# EAGLE schematic untitled (EAGLE 6.1)
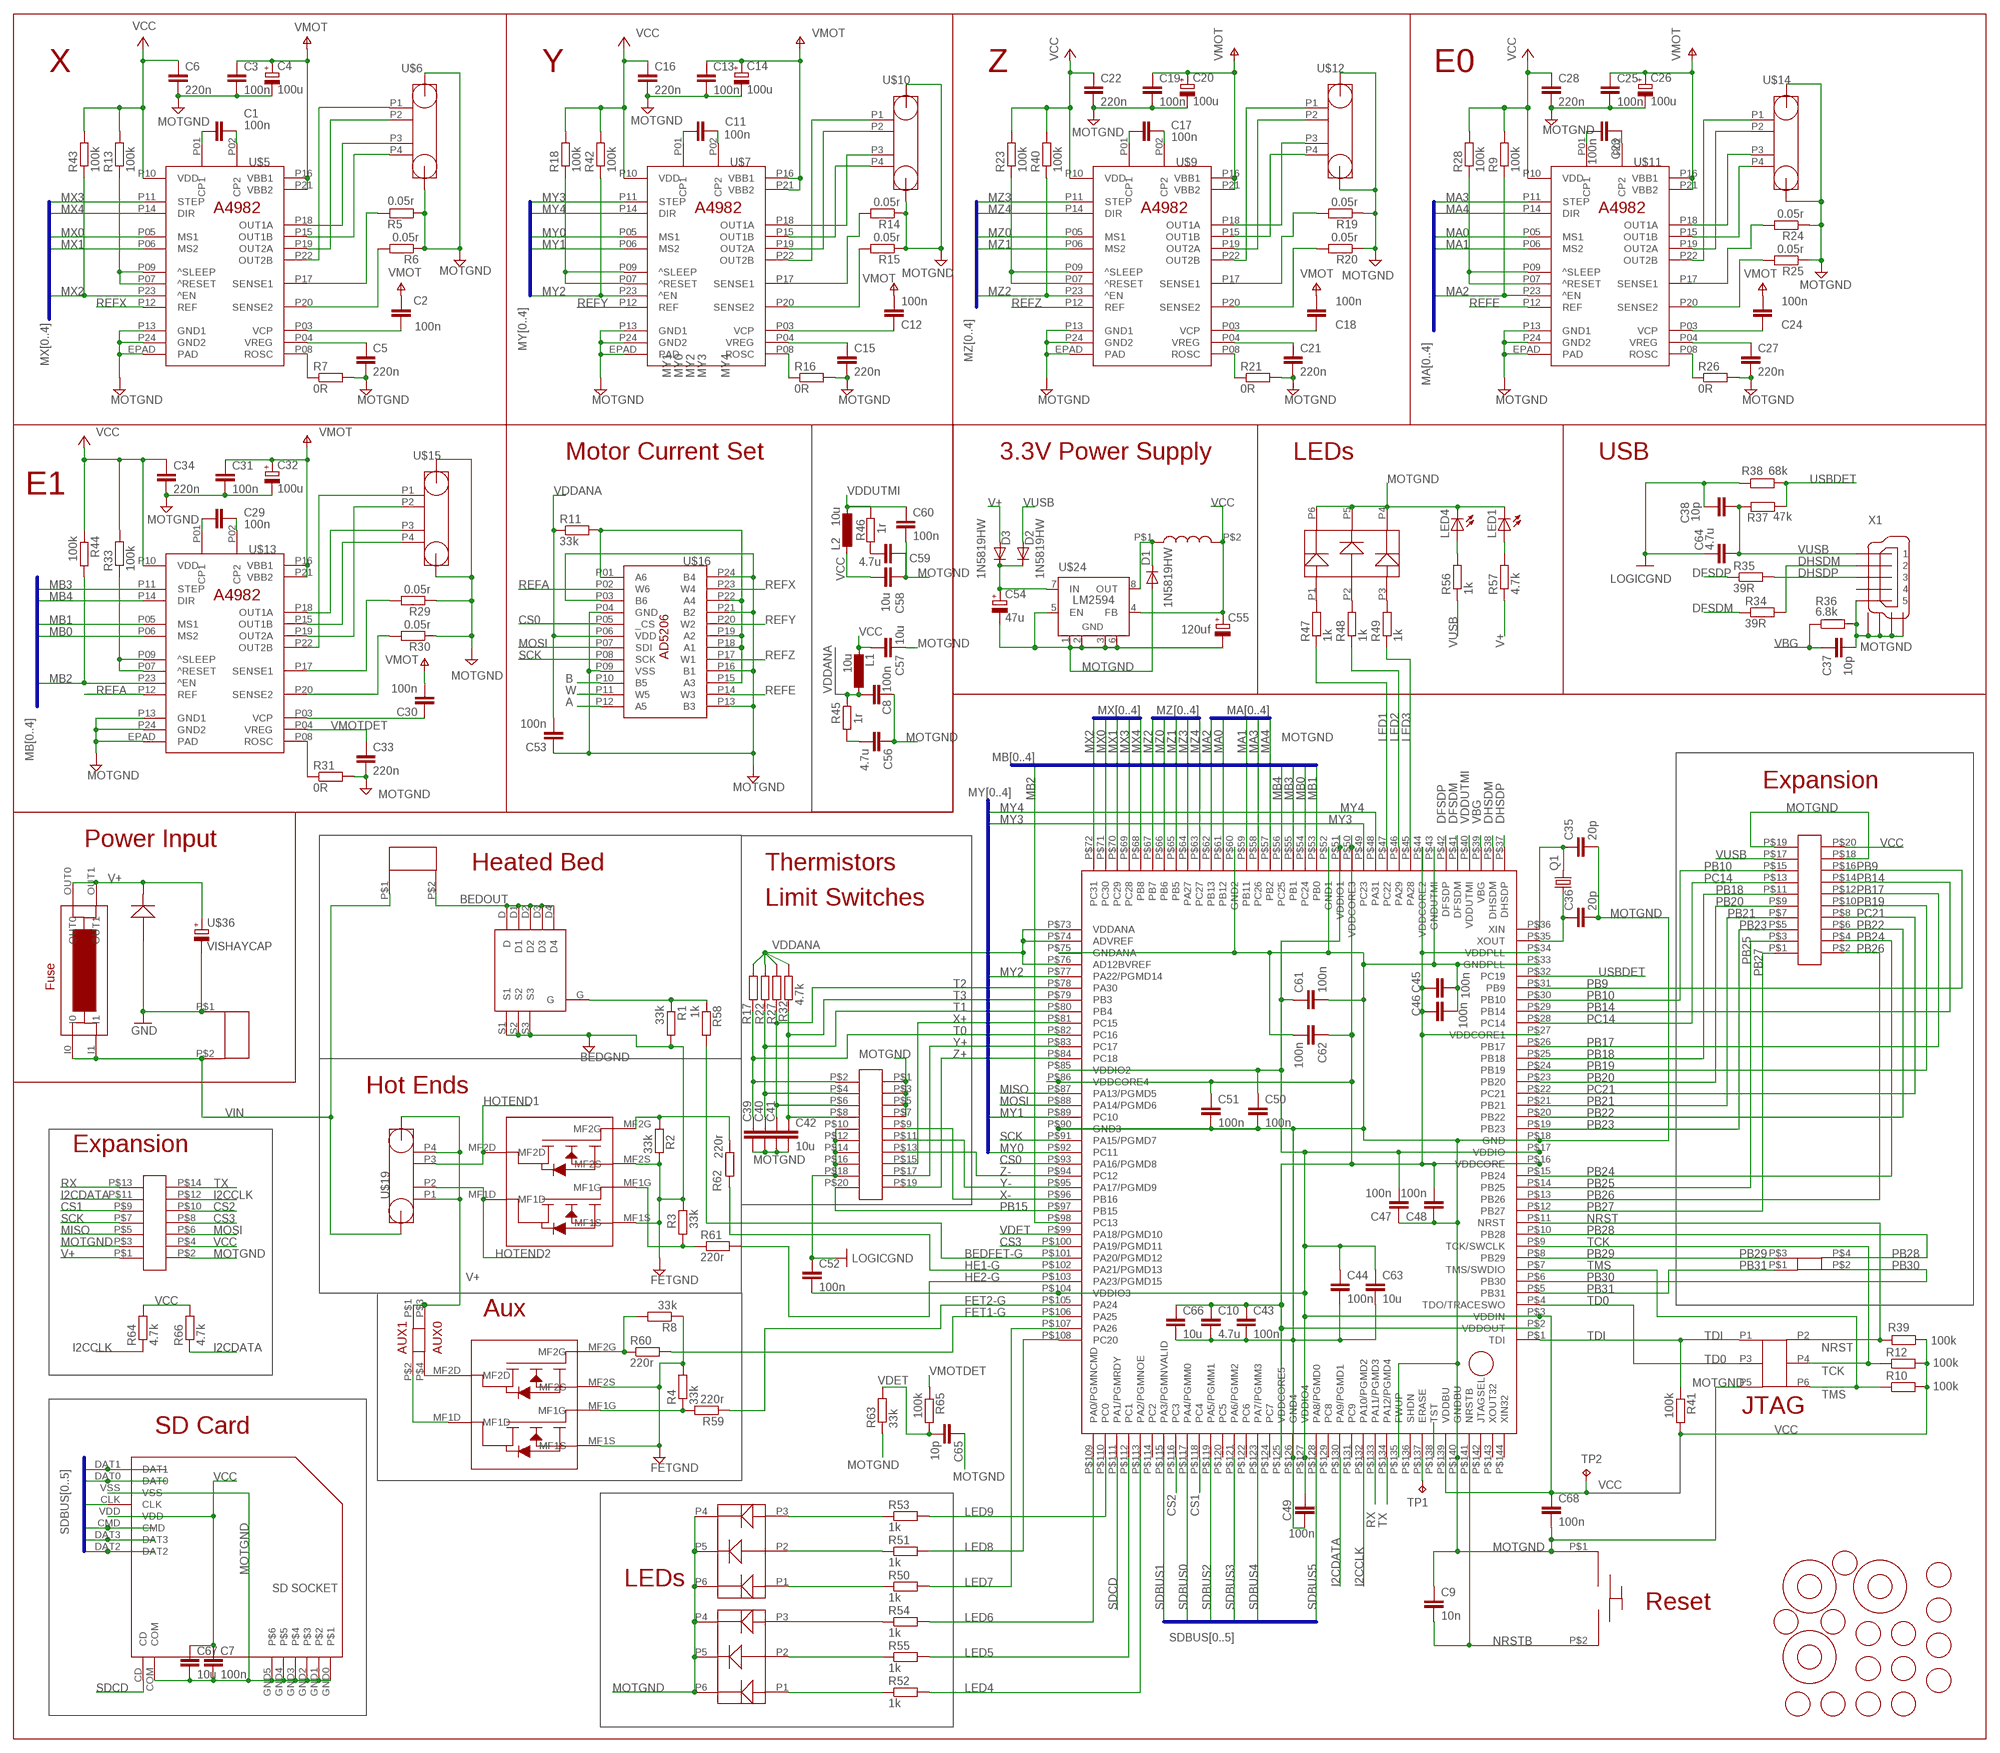
[diagram p0: schematic, sheet 1]

## Parts
C1  100n  C-EUC0603K  [C0603K]
C2  100n  C-EUC0603K  [C0603K]
C3  100n  C-EUC0603K  [C0603K]
C4  100u  CPOL-EUUD-6,3X7,7  [UD-6,3X7,7_NICHICON]
C5  220n  C-EUC0603K  [C0603K]
C6  220n  C-EUC0603K  [C0603K]
C7  100n  C-EUC0603K  [C0603K]
C8  100n  C-EUC0603K  [C0603K]
C9  10n  C-EUC0603K  [C0603K]
C10  4.7u  C-EUC0603K  [C0603K]
C11  100n  C-EUC0603K  [C0603K]
C12  100n  C-EUC0603K  [C0603K]
C13  100n  C-EUC0603K  [C0603K]
C14  100u  CPOL-EUUD-6,3X7,7  [UD-6,3X7,7_NICHICON]
C15  220n  C-EUC0603K  [C0603K]
C16  220n  C-EUC0603K  [C0603K]
C17  100n  C-EUC0603K  [C0603K]
C18  100n  C-EUC0603K  [C0603K]
C19  100n  C-EUC0603K  [C0603K]
C20  100u  CPOL-EUUD-6,3X7,7  [UD-6,3X7,7_NICHICON]
C21  220n  C-EUC0603K  [C0603K]
C22  220n  C-EUC0603K  [C0603K]
C23  100n  C-EUC0603K  [C0603K]
C24  100n  C-EUC0603K  [C0603K]
C25  100n  C-EUC0603K  [C0603K]
C26  100u  CPOL-EUUD-6,3X7,7  [UD-6,3X7,7_NICHICON]
C27  220n  C-EUC0603K  [C0603K]
C28  220n  C-EUC0603K  [C0603K]
C29  100n  C-EUC0603K  [C0603K]
C30  100n  C-EUC0603K  [C0603K]
C31  100n  C-EUC0603K  [C0603K]
C32  100u  CPOL-EUUD-6,3X7,7  [UD-6,3X7,7_NICHICON]
C33  220n  C-EUC0603K  [C0603K]
C34  220n  C-EUC0603K  [C0603K]
C35  20p  C-EUC0603K  [C0603K]
C36  20p  C-EUC0603K  [C0603K]
C37  10p  C-EUC0603K  [C0603K]
C38  10p  C-EUC0603K  [C0603K]
C39  10u  C-EUC0603K  [C0603K]
C40  10u  C-EUC0603K  [C0603K]
C41  10u  C-EUC0603K  [C0603K]
C42  10u  C-EUC0603K  [C0603K]
C43  100n  C-EUC0603K  [C0603K]
C44  100n  C-EUC0603K  [C0603K]
C45  100n  C-EUC0603K  [C0603K]
C46  100n  C-EUC0603K  [C0603K]
C47  100n  C-EUC0603K  [C0603K]
C48  100n  C-EUC0603K  [C0603K]
C49  100n  C-EUC0603K  [C0603K]
C50  100n  C-EUC0603K  [C0603K]
C51  100n  C-EUC0603K  [C0603K]
C52  100n  C-EUC0603K  [C0603K]
C53  100n  C-EUC0603K  [C0603K]
C54  47u  CPOL-EUD/7343-31R  [D/7343-31R]
C55  120uf  CPOL-EU153CLV-0807  [153CLV-0807]
C56  4.7u  C-EUC0603K  [C0603K]
C57  10u  C-EUC0603K  [C0603K]
C58  10u  C-EUC0603K  [C0603K]
C59  4.7u  C-EUC0603K  [C0603K]
C60  100n  C-EUC0603K  [C0603K]
C61  100n  C-EUC0603K  [C0603K]
C62  100n  C-EUC0603K  [C0603K]
C63  10u  C-EUC0603K  [C0603K]
C64  4.7u  C-EUC0603K  [C0603K]
C65  10p  C-EUC0603K  [C0603K]
C66  10u  C-EUC0603K  [C0603K]
C67  10u  C-EUC0603K  [C0603K]
C68  100n  C-EUC0603K  [C0603K]
D1  1N5819HW  DIODE-SOD123  [SOD123]
D2  1N5819HW  DIODE-SOD123  [SOD123]
D3  1N5819HW  DIODE-SOD123  [SOD123]
L1  10u  L-EUL2825P  [L2825P]
L2  10u  L-EUL2825P  [L2825P]
LED1  LEDCHIPLED_0805  [CHIPLED_0805]
LED4  LEDCHIPLED_0805  [CHIPLED_0805]
Q1  CSM-7X-DU  [CSM-7X-DU]
R1  33k  R-EU_R0603  [R0603]
R2  33k  R-EU_R0603  [R0603]
R3  33k  R-EU_R0603  [R0603]
R4  33k  R-EU_R0603  [R0603]
R5  0.05r  R-EU_R2512  [R2512]
R6  0.05r  R-EU_R2512  [R2512]
R7  0R  R-EU_R0603  [R0603]
R8  33k  R-EU_R0603  [R0603]
R9  100k  R-EU_R0603  [R0603]
R10  100k  R-EU_R0603  [R0603]
R11  33k  R-EU_R0603  [R0603]
R12  100k  R-EU_R0603  [R0603]
R13  100k  R-EU_R0603  [R0603]
R14  0.05r  R-EU_R2512  [R2512]
R15  0.05r  R-EU_R2512  [R2512]
R16  0R  R-EU_R0603  [R0603]
R17  4.7k  R-EU_R0603  [R0603]
R18  100k  R-EU_R0603  [R0603]
R19  0.05r  R-EU_R2512  [R2512]
R20  0.05r  R-EU_R2512  [R2512]
R21  0R  R-EU_R0603  [R0603]
R22  4.7k  R-EU_R0603  [R0603]
R23  100k  R-EU_R0603  [R0603]
R24  0.05r  R-EU_R2512  [R2512]
R25  0.05r  R-EU_R2512  [R2512]
R26  0R  R-EU_R0603  [R0603]
R27  4.7k  R-EU_R0603  [R0603]
R28  100k  R-EU_R0603  [R0603]
R29  0.05r  R-EU_R2512  [R2512]
R30  0.05r  R-EU_R2512  [R2512]
R31  0R  R-EU_R0603  [R0603]
R32  4.7k  R-EU_R0603  [R0603]
R33  100k  R-EU_R0603  [R0603]
R34  39R  R-EU_R0603  [R0603]
R35  39R  R-EU_R0603  [R0603]
R36  6.8k  R-EU_R0603  [R0603]
R37  47k  R-EU_R0603  [R0603]
R38  68k  R-EU_R0603  [R0603]
R39  100k  R-EU_R0603  [R0603]
R40  100k  R-EU_R0603  [R0603]
R41  100k  R-EU_R0603  [R0603]
R42  100k  R-EU_R0603  [R0603]
R43  100k  R-EU_R0603  [R0603]
R44  100k  R-EU_R0603  [R0603]
R45  1r  R-EU_R0603  [R0603]
R46  1r  R-EU_R0603  [R0603]
R47  1k  R-EU_R0603  [R0603]
R48  1k  R-EU_R0603  [R0603]
R49  1k  R-EU_R0603  [R0603]
R50  1k  R-EU_R0603  [R0603]
R51  1k  R-EU_R0603  [R0603]
R52  1k  R-EU_R0603  [R0603]
R53  1k  R-EU_R0603  [R0603]
R54  1k  R-EU_R0603  [R0603]
R55  1k  R-EU_R0603  [R0603]
R56  1k  R-EU_R0603  [R0603]
R57  4.7k  R-EU_R0603  [R0603]
R58  1k  R-EU_R0603  [R0603]
R59  220r  R-EU_R0603  [R0603]
R60  220r  R-EU_R0603  [R0603]
R61  220r  R-EU_R0603  [R0603]
R62  220r  R-EU_R0603  [R0603]
R63  33k  R-EU_R0603  [R0603]
R64  4.7k  R-EU_R0603  [R0603]
R65  100k  R-EU_R0603  [R0603]
R66  4.7k  R-EU_R0603  [R0603]
TP1  TPTP20R  [TP20R]
TP2  TPTP20R  [TP20R]
U$1  IPG20N04S4L-11  [SUPERSO8]
U$2  IPG20N04S4L-11  [SUPERSO8]
U$3  SMD.1X20  [SMD0.1X20]
U$4  IRFH6200  [PQFNFET]
U$5  A4982  [ETSSOP24]
U$6  210-A-126-SMD  [210-A-126-SMD-4]
U$7  A4982  [ETSSOP24]
U$8  SAM3U4E  [LQFP144]
U$9  A4982  [ETSSOP24]
U$10  210-A-126-SMD  [210-A-126-SMD-4]
U$11  A4982  [ETSSOP24]
U$12  210-A-126-SMD  [210-A-126-SMD-4]
U$13  A4982  [ETSSOP24]
U$14  210-A-126-SMD  [210-A-126-SMD-4]
U$15  210-A-126-SMD  [210-A-126-SMD-4]
U$16  AD5206  [TSSOP24]
U$17  SMD.1X20  [SMD0.1X20]
U$18  SMD.1X6  [SMD0.1X6]
U$19  210-A-126-SMD  [210-A-126-SMD-4]
U$20  SMD.1  [SMD0.1]
U$21  950-D-SMD-DS-2  [950-D-SMD-2]
U$22  974-D-SMD-2  [974-D-SMD-2]
U$23  GFUD  [FIDUCIAL_G10]
U$24  LM2594  [SO08]
U$25  SDCARD  [SDCARD]
U$26  FUSE  [FUSEHOLDER]
U$27  BUTTON  [BUTTON]
U$28  SMD.1  [SMD0.1]
U$29  GFUD  [FIDUCIAL_G10]
U$30  GFUD  [FIDUCIAL_G10]
U$31  100uH  INDUCTOR  [INDUCTOR]
U$32  FM4004  [SMX]
U$33  OMRONLED  [OMRONLED]
U$34  OMRONLED  [OMRONLED]
U$35  OMRONLED  [OMRONLED]
U$36  VISHAYCAP  CPOL-EU153CLV-0810  [153CLV-0810]
U$37  LFUD  [FIDUCIAL_L10]
U$38  LFUD  [FIDUCIAL_L10]
U$39  LFUD  [FIDUCIAL_L10]
U$40  LFUD  [FIDUCIAL_L10]
U$41  LFUD  [FIDUCIAL_L10]
U$42  LFUD  [FIDUCIAL_L10]
U$43  SMD.1X14  [SMD0.1X14]
U$44  LFUD  [FIDUCIAL_L10]
U$45  LFUD  [FIDUCIAL_L10]
U$46  LFUD  [FIDUCIAL_L10]
U$47  LFUD  [FIDUCIAL_L10]
U$48  LFUD  [FIDUCIAL_L10]
U$49  LFUD  [FIDUCIAL_L10]
U$50  LFUD  [FIDUCIAL_L10]
U$51  LFUD  [FIDUCIAL_L10]
U$52  LFUD  [FIDUCIAL_L10]
X1  USBC  [USBC]

## Nets
A: U$16.P12(A5)
B: U$16.P10(B5)
BEDFET-G: R58.2 U$8.P$101(PA20/PGMD12)
BEDOUT: U$4.D U$4.D1 U$4.D2 U$4.D3 U$4.D4 U$21.P$2
CS0: U$8.P$93(PA16/PGMD8) U$16.P05(_CS)
CS1: U$8.P$118(PC4) U$43.P$9
CS2: U$8.P$116(PC3) U$43.P$10
CS3: U$8.P$100(PA19/PGMD11) U$43.P$8
DFSDM: R34.1 U$8.P$41(DFSDM)
DFSDP: R35.1 U$8.P$42(DFSDP)
DHSDM: R34.2 U$8.P$38(DHSDM) X1.2
DHSDP: R35.2 U$8.P$37(DHSDP) X1.3
FET1-G: R60.2 U$8.P$106(PA25)
FET2-G: R59.1 U$8.P$105(PA24)
HE1-G: R62.2 U$8.P$102(PA21/PGMD13)
HE2-G: R61.2 U$8.P$103(PA23/PGMD15)
HOTEND1: U$2.MF2D U$19.P3
HOTEND2: U$2.MF1D U$19.P2
I2CCLK: R64.1 U$8.P$132(PA10/PGMD2) U$43.P$12
I2CDATA: R66.1 U$8.P$130(PA9/PGMD1) U$43.P$11
LED1: R47.1 U$8.P$47(PC22)
LED2: R48.1 U$8.P$46(PA29)
LED3: R49.1 U$8.P$45(PA28)
LED4: R52.2 U$8.P$113(PA2/PGMNOE)
LED5: R55.2 U$8.P$112(PC1)
LED6: R54.2 U$8.P$109(PA0/PGMNCMD)
LED7: R50.2 U$8.P$107(PA26)
LED8: R51.2 U$8.P$108(PC20)
LED9: R53.2 U$8.P$110(PC0)
MA0: U$8.P$61(PB12) U$11.P05(MS1)
MA1: U$8.P$59(PB11) U$11.P06(MS2)
MA2: R9.1 U$8.P$62(PB13) U$11.P23(^EN)
MA3: U$8.P$58(PC26) U$11.P11(STEP)
MA4: U$8.P$57(PB2) U$11.P14(DIR)
MB0: U$8.P$54(PC24) U$13.P06(MS2)
MB1: U$8.P$53(PB0) U$13.P05(MS1)
MB2: R44.2 U$8.P$98(PC13) U$13.P23(^EN)
MB3: U$8.P$55(PB1) U$13.P11(STEP)
MB4: U$8.P$56(PC25) U$13.P14(DIR)
MISO: U$8.P$87(PA13/PGMD5) U$43.P$5
MOSI: U$8.P$88(PA14/PGMD6) U$16.P07(SDI) U$43.P$6
MOTGND: C3.2 C4.- C5.2 C6.2 C7.2 C8.2 C9.1 C10.2 C13.2 C14.- C15.2 C16.2 C19.2 C20.- C21.2 C22.2 C25.2 C26.- C27.2 C28.2 C31.2 C32.- C33.2 C34.2 C35.2 C36.2 C37.2 C38.2 C39.2 C40.2 C41.2 C42.2 C43.2 C44.2 C45.2 C46.1 C47.1 C48.1 C49.2 C50.2 C51.2 C52.1 C53.1 C54.- C55.- C56.1 C57.1 C58.1 C59.1 C60.2 C61.2 C62.2 C63.2 C64.1 C65.1 C66.2 C67.2 C68.2 D1.A LED1.C LED4.C R1.2 R2.2 R3.2 R4.2 R5.1 R6.1 R7.2 R8.1 R14.1 R15.1 R16.2 R19.1 R20.1 R21.2 R24.1 R25.1 R26.2 R29.1 R30.1 R31.2 R36.2 R38.1 R63.1 U$1.MF1S U$1.MF2S U$2.MF1S U$2.MF2S U$3.P$18 U$3.P$19 U$4.S1 U$4.S2 U$4.S3 U$5.EPAD(PAD) U$5.P13(GND1) U$5.P24(GND2) U$6.GND0 U$6.GND1 U$7.EPAD(PAD) U$7.P13(GND1) U$7.P24(GND2) U$8.P$18(GND) U$8.P$33(GNDPLL) U$8.P$43(GNDUTMI) U$8.P$52(GND1) U$8.P$60(GND2) U$8.P$75(GNDANA) U$8.P$90(GND3) U$8.P$126(GND4) U$8.P$135(FWUP) U$8.P$140(GNDBU) U$9.EPAD(PAD) U$9.P13(GND1) U$9.P24(GND2) U$10.GND0 U$10.GND1 U$11.EPAD(PAD) U$11.P13(GND1) U$11.P24(GND2) U$12.GND0 U$12.GND1 U$13.EPAD(PAD) U$13.P13(GND1) U$13.P24(GND2) U$14.GND0 U$14.GND1 U$15.GND0 U$15.GND1 U$16.P03(B6) U$16.P04(GND) U$16.P09(VSS) U$16.P13(B3) U$16.P16(B1) U$16.P21(B2) U$16.P24(B4) U$17.P$1 U$17.P$3 U$17.P$5 U$17.P$7 U$17.P$10 U$17.P$12 U$17.P$14 U$17.P$16 U$17.P$18 U$18.P5 U$22.P$1 U$24.1(GND) U$24.2(GND1) U$24.3(GND2) U$24.5(EN) U$24.6(GND) U$25.COM U$25.GND0 U$25.GND1 U$25.GND2 U$25.GND3 U$25.GND4 U$25.GND5 U$25.VSS U$27.P$1 U$32.P$2 U$33.P4 U$33.P5 U$33.P6 U$34.P4 U$34.P5 U$34.P6 U$35.P4 U$35.P5 U$35.P6 U$36.- U$43.P$2 U$43.P$3 X1.5 X1.M1 X1.M2 X1.M3 X1.M4 ; supply symbol labelled GND, LOGICGND, FETGND, BEDGND
MX0: U$5.P05(MS1) U$8.P$71(PC30)
MX1: U$5.P06(MS2) U$8.P$70(PC29)
MX2: R43.1 U$5.P23(^EN) U$8.P$72(PC31)
MX3: U$5.P11(STEP) U$8.P$69(PC28)
MX4: U$5.P14(DIR) U$8.P$68(PB8)
MY0: U$7.P05(MS1) U$8.P$92(PC11)
MY1: U$7.P06(MS2) U$8.P$89(PC10)
MY2: R42.1 U$7.P23(^EN) U$8.P$77(PA22/PGMD14)
MY3: U$7.P11(STEP) U$8.P$49(PC23)
MY4: U$7.P14(DIR) U$8.P$48(PA31)
MZ0: U$8.P$66(PB6) U$9.P05(MS1)
MZ1: U$8.P$65(PB5) U$9.P06(MS2)
MZ2: R40.1 U$8.P$67(PB7) U$9.P23(^EN)
MZ3: U$8.P$64(PA27) U$9.P11(STEP)
MZ4: U$8.P$63(PC27) U$9.P14(DIR)
N$5: R11.2 U$16.P01(A6) U$16.P15(A3) U$16.P18(A1) U$16.P19(A2) U$16.P22(A4)
N$6: R5.2 U$5.P17(SENSE1)
N$7: R6.2 U$5.P20(SENSE2)
N$9: C1.2 U$5.P01(CP1)
N$10: C1.1 U$5.P02(CP2)
N$11: C2.1 U$5.P03(VCP)
N$12: R13.1 U$5.P07(^RESET) U$5.P09(^SLEEP)
N$13: TP1.TP U$8.P$137(ERASE)
N$14: R15.2 U$7.P20(SENSE2)
N$15: C5.1 U$5.P04(VREG)
N$16: R7.1 U$5.P08(ROSC)
N$20: U$5.P15(OUT1B) U$6.P4
N$21: U$5.P19(OUT2A) U$6.P2
N$23: C11.2 U$7.P01(CP1)
N$24: U$5.P22(OUT2B) U$6.P1
N$27: R1.1 R58.1 U$4.G
N$28: C23.2 U$11.P01(CP1)
N$29: R29.2 U$13.P17(SENSE1)
N$30: R30.2 U$13.P20(SENSE2)
N$31: C23.1 U$11.P02(CP2)
N$33: C29.2 U$13.P01(CP1)
N$34: R4.1 R59.2 U$1.MF1G
N$35: C29.1 U$13.P02(CP2)
N$36: C24.1 U$11.P03(VCP)
N$37: R28.1 U$11.P07(^RESET) U$11.P09(^SLEEP)
N$38: C17.2 U$9.P01(CP1)
N$39: C27.1 U$11.P04(VREG)
N$40: C18.1 U$9.P03(VCP)
N$41: R26.1 U$11.P08(ROSC)
N$43: R21.1 U$9.P08(ROSC)
N$44: U$9.P19(OUT2A) U$12.P2
N$45: U$9.P15(OUT1B) U$12.P4
N$46: U$11.P19(OUT2A) U$14.P2
N$48: U$11.P15(OUT1B) U$14.P4
N$49: R8.2 R60.1 U$1.MF2G
N$50: R3.1 R61.1 U$2.MF1G
N$54: R33.1 U$13.P07(^RESET) U$13.P09(^SLEEP)
N$56: U$5.P18(OUT1A) U$6.P3
N$58: U$13.P15(OUT1B) U$15.P4
N$60: R14.2 U$7.P17(SENSE1)
N$61: C30.1 U$13.P03(VCP)
N$64: C11.1 U$7.P02(CP2)
N$65: C12.1 U$7.P03(VCP)
N$67: R2.1 R62.1 U$2.MF2G
N$68: C15.1 U$7.P04(VREG)
N$69: R16.1 U$7.P08(ROSC)
N$71: U$1.MF2D U$20.P$4
N$72: U$11.P18(OUT1A) U$14.P3
N$74: U$7.P19(OUT2A) U$10.P2
N$75: R31.1 U$13.P08(ROSC)
N$76: R19.2 U$9.P17(SENSE1)
N$77: U$1.MF1D U$20.P$2
N$78: U$7.P15(OUT1B) U$10.P4
N$79: U$13.P19(OUT2A) U$15.P2
N$80: R18.1 U$7.P07(^RESET) U$7.P09(^SLEEP)
N$81: C17.1 U$9.P02(CP2)
N$84: U$13.P22(OUT2B) U$15.P1
N$89: U$7.P22(OUT2B) U$10.P1
N$90: U$9.P18(OUT1A) U$12.P3
N$92: U$9.P22(OUT2B) U$12.P1
N$98: U$7.P18(OUT1A) U$10.P3
N$103: U$13.P18(OUT1A) U$15.P3
N$105: R20.2 U$9.P20(SENSE2)
N$109: R23.1 U$9.P07(^RESET) U$9.P09(^SLEEP)
N$129: R24.2 U$11.P17(SENSE1)
N$130: R25.2 U$11.P20(SENSE2)
N$139: U$11.P22(OUT2B) U$14.P1
N$154: D1.C U$24.8(OUT) U$31.P$1
N$156: C54.+ D2.C D3.C U$24.7(IN)
N$157: C56.2 R45.1
N$159: C59.2 R46.1
N$160: R48.2 U$33.P2
N$161: R50.1 U$34.P1
N$162: R51.1 U$34.P2
N$172: R53.1 U$34.P3
N$173: R55.1 U$35.P2
N$174: R54.1 U$35.P3
N$175: R52.1 U$35.P1
N$176: R49.2 U$33.P3
N$177: R47.2 U$33.P1
N$178: LED4.A R56.2
N$179: LED1.A R57.2
NRST: R39.2 U$8.P$11(NRST) U$18.P2
NRSTB: C9.2 U$8.P$141(NRSTB) U$27.P$2
PB9: U$3.P$16 U$8.P$31(PB9)
PB10: U$3.P$15 U$8.P$30(PB10)
PB14: U$3.P$14 U$8.P$29(PB14)
PB15: U$8.P$97(PB15) U$17.P$20
PB17: U$3.P$12 U$8.P$26(PB17)
PB18: U$3.P$11 U$8.P$25(PB18)
PB19: U$3.P$10 U$8.P$24(PB19)
PB20: U$3.P$9 U$8.P$23(PB20)
PB21: U$3.P$7 U$8.P$21(PB21)
PB22: U$3.P$6 U$8.P$20(PB22)
PB23: U$3.P$5 U$8.P$19(PB23)
PB24: U$3.P$4 U$8.P$15(PB24)
PB25: U$3.P$3 U$8.P$14(PB25)
PB26: U$3.P$2 U$8.P$13(PB26)
PB27: U$3.P$1 U$8.P$12(PB27)
PB28: U$8.P$10(PB28) U$28.P$4
PB29: U$8.P$8(PB29) U$28.P$3
PB30: U$8.P$6(PB30) U$28.P$2
PB31: U$8.P$5(PB31) U$28.P$1
PC14: U$3.P$13 U$8.P$28(PC14)
PC21: U$3.P$8 U$8.P$22(PC21)
REFA: U$13.P12(REF) U$16.P02(W6)
REFE: U$11.P12(REF) U$16.P14(W3)
REFX: U$5.P12(REF) U$16.P23(W4)
REFY: U$7.P12(REF) U$16.P20(W2)
REFZ: U$9.P12(REF) U$16.P17(W1)
RX: U$8.P$133(PA11/PGMD3) U$43.P$13
SCK: U$8.P$91(PA15/PGMD7) U$16.P08(SCK) U$43.P$7
SDBUS0: U$8.P$117(PA4/PGMM0) U$25.CMD
SDBUS1: U$8.P$115(PA3/PGMNVALID) U$25.CLK
SDBUS2: U$8.P$119(PA5/PGMM1) U$25.DAT0
SDBUS3: U$8.P$121(PA6/PGMM2) U$25.DAT1
SDBUS4: U$8.P$123(PA7/PGMM3) U$25.DAT2
SDBUS5: U$8.P$128(PA8/PGMD0) U$25.DAT3
SDCD: U$8.P$111(PA1/PGMRDY) U$25.CD
T0: C39.1 R17.1 U$8.P$82(PC16) U$17.P$2
T1: C40.1 R22.1 U$8.P$80(PB4) U$17.P$4
T2: C41.1 R27.1 U$8.P$78(PA30) U$17.P$6
T3: C42.1 R32.1 U$8.P$79(PB3) U$17.P$8
TCK: R12.1 U$8.P$9(TCK/SWCLK) U$18.P4
TD0: U$8.P$4(TDO/TRACESWO) U$18.P3
TDI: R41.1 U$8.P$1(TDI) U$18.P1
TMS: R10.1 U$8.P$7(TMS/SWDIO) U$18.P6
TST: U$8.P$138(TST)
TX: U$8.P$134(PA12/PGMD4) U$43.P$14
USBDET: R37.1 R38.2 U$8.P$32(PC19)
V+: C2.2 C3.1 C4.+ C12.2 C13.1 C14.+ C18.2 C19.1 C20.+ C24.2 C25.1 C26.+ C30.2 C31.1 C32.+ D3.A R57.1 U$5.P16(VBB1) U$5.P21(VBB2) U$7.P16(VBB1) U$7.P21(VBB2) U$9.P16(VBB1) U$9.P21(VBB2) U$11.P16(VBB1) U$11.P21(VBB2) U$13.P16(VBB1) U$13.P21(VBB2) U$19.GND1 U$19.P1 U$19.P4 U$20.P$1 U$20.P$3 U$26.OUT0 U$26.OUT1 U$32.P$1 U$36.+ U$43.P$1 ; supply symbol labelled VMOT
VBG: C37.1 R36.1 U$8.P$39(VBG)
VCC: C6.1 C7.1 C16.1 C22.1 C28.1 C34.1 C44.1 C47.2 C49.1 C50.1 C52.2 C55.+ C57.2 C58.2 C61.1 C63.1 C67.1 C68.1 L1.2 L2.1 R9.2 R10.2 R12.2 R13.2 R18.2 R23.2 R28.2 R33.2 R39.1 R40.2 R41.2 R42.2 R43.2 R44.1 R64.2 R66.2 TP2.TP U$3.P$20 U$5.P10(VDD) U$7.P10(VDD) U$8.P$3(VDDIN) U$8.P$17(VDDIO) U$8.P$51(VDDIO1) U$8.P$85(VDDIO2) U$8.P$104(VDDIO3) U$8.P$127(VDDIO4) U$8.P$139(VDDBU) U$9.P10(VDD) U$11.P10(VDD) U$13.P10(VDD) U$24.4(FB) U$25.VDD U$31.P$2 U$43.P$4
VCORE: C10.1 C43.1 C45.1 C46.2 C48.2 C51.1 C62.1 C66.1 U$8.P$2(VDDOUT) U$8.P$16(VDDCORE) U$8.P$27(VDDCORE1) U$8.P$34(VDDPLL) U$8.P$44(VDDCORE2) U$8.P$50(VDDCORE3) U$8.P$86(VDDCORE4) U$8.P$125(VDDCORE5)
VDDANA: C8.1 C53.2 L1.1 R11.1 R17.2 R22.2 R27.2 R32.2 R45.2 U$8.P$73(VDDANA) U$8.P$74(ADVREF) U$8.P$76(AD12BVREF) U$16.P06(VDD)
VDDUTMI: C60.1 L2.2 R46.2 U$8.P$40(VDDUTMI)
VDET: C65.2 R63.2 R65.2 U$8.P$99(PA18/PGMD10)
VIN: U$19.GND0 U$21.P$1 U$22.P$2 U$26.I0 U$26.I1
VMOTDET: C33.1 R65.1 U$13.P04(VREG)
VREG: C21.1 U$9.P04(VREG)
VUSB: C38.1 C64.2 D2.A R37.2 R56.1 U$3.P$17 X1.1
W: U$16.P11(W5)
X+: U$8.P$81(PC15) U$17.P$15
X-: U$8.P$96(PB16) U$17.P$9
XTAL1: C35.1 Q1.2 U$8.P$36(XIN)
XTAL2: C36.1 Q1.1 U$8.P$35(XOUT)
Y+: U$8.P$83(PC17) U$17.P$17
Y-: U$8.P$95(PA17/PGMD9) U$17.P$11
Z+: U$8.P$84(PC18) U$17.P$19
Z-: U$8.P$94(PC12) U$17.P$13
Unconnected: U$8.P$114(PC2) U$8.P$120(PC5) U$8.P$122(PC6) U$8.P$124(PC7) U$8.P$129(PC8) U$8.P$131(PC9) U$8.P$136(SHDN) U$8.P$142(JTAGSEL) U$8.P$143(XOUT32) U$8.P$144(XIN32) X1.4

## Buses
SDBUS[0..5]
MX[0..4]
MY[0..4]
MZ[0..4]
MA[0..4]
MB[0..4]

## Notes on the sheet
- X | Y | Z | E0
- Motor Current Set | 3.3V Power Supply | LEDs | USB
- E1
- Expansion
- Power Input
- Heated Bed | Thermistors
- Limit Switches
- Fuse
- Hot Ends
- Expansion
- Aux
- AUX1 | AUX0
- JTAG
- SD Card
- LEDs
- SD SOCKET
- Reset

## Library data of the parts
C1-C3 C5-C13 C15-C19 C21-C25 C27-C31 C33-C53 C56-C68 = rcl:C-EU: CAPACITOR, European symbol
C4 C14 C20 C26 C32 C54 C55 U$36 = rcl:CPOL-EU: POLARIZED CAPACITOR, European symbol
D1-D3 = diode:DIODE-: DIODE
L1 L2 = rcl:L-EU: INDUCTOR, European symbol
LED1 LED4 = led:LED: LED OSRAM: - CHIPLED LG R971, LG N971, LY N971, LG Q971, LY Q971, LO R971, LY R971 LH N974, LH R974 LS Q976, LO Q976, LY Q976 LO Q996 - Hyper CHIPLED LW Q18S LB Q993, LB Q99A, LB R99A - SideLED LS A670, LO A670, LY A670, LG A670, LP A670 LB A673, LV A673, LT A673, LW A673 LH A674 LY A675 LS A676, LA A676, LO A676, LY A676, LW A676 LS A679, LY A679, LG A679 - Hyper Micro SIDELED® LS Y876, LA Y876, LO Y876, LY Y876 LT Y87S - SmartLED LW L88C, LW L88S LB L89C, LB L89S, LG L890 LS L89K, LO L89K, LY L89K LS L896, LA L896, LO L896, LY L896 - TOPLED LS T670, LO T670, LY T670, LG T670, LP T670 LSG T670, LSP T670, LSY T670, LOP T670, LYG T670 LG T671, LOG T671, LSG T671 LB T673, LV T673, LT T673, LW T673 LH T674 LS T676, LA T676, LO T676, LY T676, LB T676, LH T676, LSB T676, LW T676 LB T67C, LV T67C, LT T67C, LS T67K, LO T67K, LY T67K, LW E67C LS E67B, LA E67B, LO E67B, LY E67B, LB E67C, LV E67C, LT E67C LW T67C LS T679, LY T679, LG T679 LS T770, LO T770, LY T770, LG T770, LP T770 LB T773, LV T773, LT T773, LW T773 LH T774 LS E675, LA E675, LY E675, LS T675 LS T776, LA T776, LO T776, LY T776, LB T776 LHGB T686 LT T68C, LB T68C - Hyper Mini TOPLED® LB M676 - Mini TOPLED Santana® LG M470 LS M47K, LO M47K, LY M47K Source: http://www.osram.convergy.de LUXEON: - LUMILED® LXK2-PW12-R00, LXK2-PW12-S00, LXK2-PW14-U00, LXK2-PW14-V00 LXK2-PM12-R00, LXK2-PM12-S00, LXK2-PM14-U00 LXK2-PE12-Q00, LXK2-PE12-R00, LXK2-PE12-S00, LXK2-PE14-T00, LXK2-PE14-U00 LXK2-PB12-K00, LXK2-PB12-L00, LXK2-PB12-M00, LXK2-PB14-N00, LXK2-PB14-P00, LXK2-PB14-Q00 LXK2-PR12-L00, LXK2-PR12-M00, LXK2-PR14-Q00, LXK2-PR14-R00 LXK2-PD12-Q00, LXK2-PD12-R00, LXK2-PD12-S00 LXK2-PH12-R00, LXK2-PH12-S00 LXK2-PL12-P00, LXK2-PL12-Q00, LXK2-PL12-R00 Source: www.luxeon.com KINGBRIGHT: KA-3528ASYC Source: www.kingbright.com
Q1 = crystal:CSM-7X-DU: SMD CRYSTAL Source: www.ecsxtal.com .. Crystal 3.6864MHz CSM_7X_DU.PDF; OC_FARNELL: unknown; OC_NEWARK: unknown
R1-R4 R7-R13 R16-R18 R21-R23 R26-R28 R31-R66 = rcl:R-EU_: RESISTOR, European symbol
R5 R6 R14 R15 R19 R20 R24 R25 R29 R30 = resistor:R-EU_: RESISTOR, European symbol
TP1 TP2 = testpad:TP: Test pad
U$1 U$2 = untitled:IPG20N04S4L-11
U$3 U$17 = untitled:SMD.1X20
U$4 = untitled:IRFH6200
U$5 U$7 U$9 U$11 U$13 = untitled:A4982
U$6 U$10 U$12 U$14 U$15 U$19 = untitled:210-A-126-SMD
U$8 = untitled:SAM3U4E
U$16 = untitled:AD5206
U$18 = untitled:SMD.1X6
U$20 U$28 = untitled:SMD.1
U$21 = untitled:950-D-SMD-DS-2
U$22 = untitled:974-D-SMD-2
U$23 U$29 U$30 = dicons:GFUD
U$24 = LM2594:LM2594
U$25 = untitled:SDCARD
U$26 = untitled:FUSE
U$27 = untitled:BUTTON
U$31 = untitled:INDUCTOR
U$32 = untitled:FM4004
U$33-U$35 = untitled:OMRONLED
U$37-U$42 U$44-U$52 = dicons:LFUD
U$43 = untitled:SMD.1X14
X1 = untitled:USBC